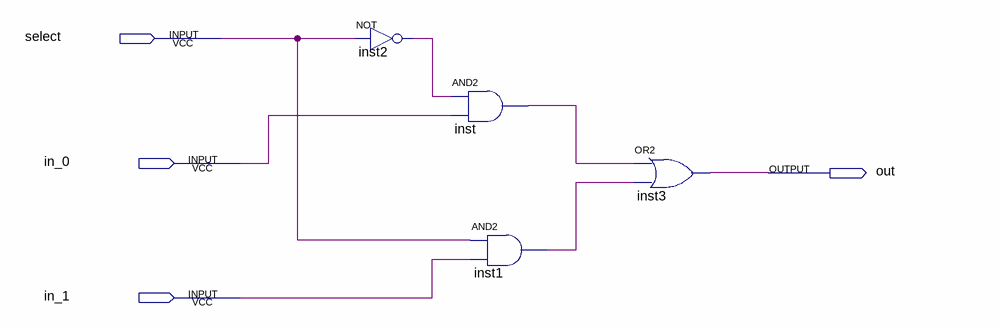
[diagram p0: schematic sheet]
// Quartus schematic mux_1.bdf as structural Verilog: 4 symbols, 4 pins
module mux_1 (
  input  select,
  input  in_0,
  input  in_1,
  output out
);

  wire inst1_out, inst2_out, inst_out;

  not inst2 (inst2_out, select);
  and inst (inst_out, inst2_out, in_0);
  and inst1 (inst1_out, select, in_1);
  or inst3 (out, inst_out, inst1_out);
endmodule
